# Altium schematic sheet Project2.SchDoc
size A; SheetNumber: 1; SheetTotal: 1
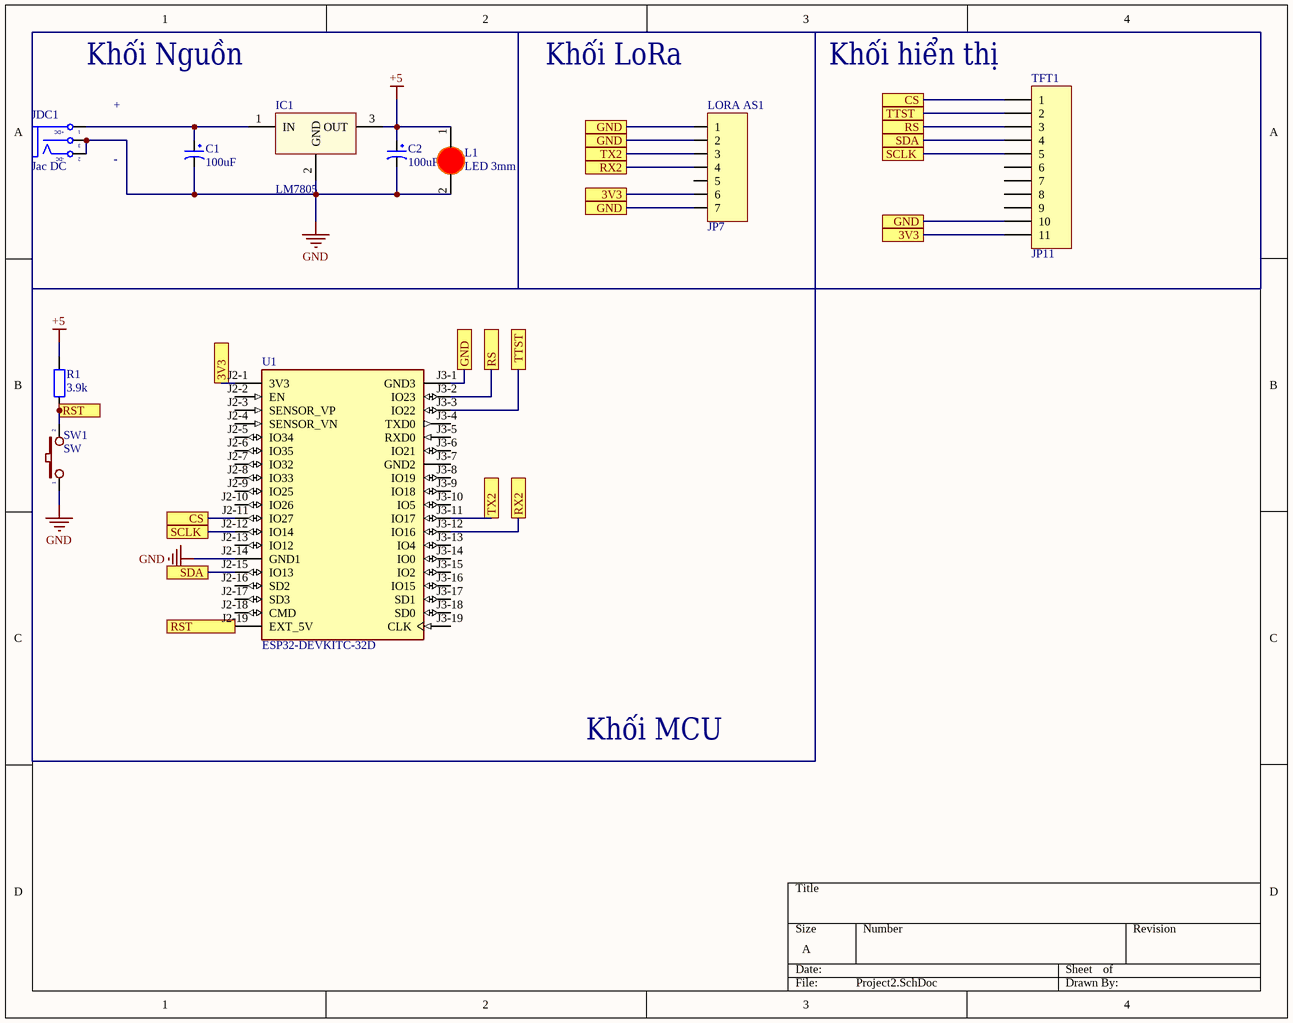
[diagram p0: Project2.SchDoc]

## Parts
C1  100uF  [Tu hoa 10mm]
C2  100uF  [Tu hoa 10mm]
IC1  LM7805  [QTO-220]
JDC1  Jac DC  [DC-IN]
L1  LED 3mm  [LED-3MM-RED]
LORA_AS1  JP7  [JP7-C1C]
R1  3.9k  [tro vach 1/4w]
SW1  SW  [SW2]
TFT1  JP11  [JP11-C1T]
U1  ESP32-DEVKITC-32D  [MODULE_ESP32-DEVKITC-32D]

## Ports
3V3, CS, GND, RS, RST, RX2, SCLK, SDA, TTST, TX2

## Nets
+5: C2.1 IC1.3(OUT) L1.1(A) R1.2
GND: C1.2 C2.2 IC1.2(GND) JDC1.2(TN) JDC1.3(S) L1.2(K) SW1.1 U1.J2-14(GND1)
3V3: LORA_AS1.6 TFT1.11 U1.J2-1(3V3) ; port 3V3
CS: TFT1.1 U1.J2-11(IO27) ; port CS
GND: LORA_AS1.1 LORA_AS1.2 LORA_AS1.7 TFT1.10 U1.J3-1(GND3) ; port GND  [a separate net that carries the same name]
RS: TFT1.3 U1.J3-2(IO23) ; port RS
RST: R1.1 SW1.2 U1.J2-19(EXT_5V) ; port RST
RX2: LORA_AS1.4 U1.J3-12(IO16) ; port RX2
SCLK: TFT1.5 U1.J2-12(IO14) ; port SCLK
SDA: TFT1.4 U1.J2-15(IO13) ; port SDA
TTST: TFT1.2 U1.J3-3(IO22) ; port TTST
TX2: LORA_AS1.3 U1.J3-11(IO17) ; port TX2
NetC1_1: C1.1 IC1.1(IN) JDC1.1(T)

Not connected (* = marked no-connect by the designer): LORA_AS1 5; TFT1 6 7 8 9; U1 J2-2(EN) J2-3(SENSOR_VP) J2-4(SENSOR_VN) J2-5(IO34) J2-6(IO35) J2-7(IO32) J2-8(IO33) J2-9(IO25) J2-10(IO26) J2-13(IO12) J2-16(SD2) J2-17(SD3) J2-18(CMD) J3-4(TXD0) J3-5(RXD0) J3-6(IO21) J3-7(GND2) J3-8(IO19) J3-9(IO18) J3-10(IO5) J3-13(IO4) J3-14(IO0) J3-15(IO2) J3-16(IO15) J3-17(SD1) J3-18(SD0) J3-19(CLK)

## Notes on the sheet
- Khối Nguồn
- Khối LoRa
- (near TFT1) Khối hiển thị
- (near JDC1) +
- (near JDC1) -
- Khối MCU
- (in symbol DCIN) +DC; -DC

## Library data of the parts
C1 C2 = Tu Hoa 100uF 100V 10x20: Cắm; Don_Vi: Con; So_Chan: 2; Ten_Linh_Kien: Tụ Hóa 100uF 100V 10x20MM; Ma_Hang: MH003150; Chung_Loai: Cắm; Kieu_Chan: *
IC1 = LM78xx: On ap +, from + 5 to + 24VDC; Value: LM7805
JDC1 = DCIN: Jac DC input; Value: Jac DC
L1 = LED 3mm Do: Cắm; Don_Vi: Con; Ma_Hang: MH003892; Ten_Linh_Kien: Led 3MM Phủ Đỏ (10c); Ghi_Chu: *; Kieu_Chan: *; Chung_Loai: Cắm
LORA_AS1 = JP7: WR-PHD 2.54 mm Angled Socket Header; Manufacturer: W¨¹rth Elektronik eiSos GmbH; partNo: 613007143121; ComponentLink1 Description: Manufacturer; ComponentLink2 Description: Datasheet; NoPins: 07; Created Date: 29 March 2013; ComponentLink1URL: http://www.we-online.com; ComponentLink2URL: http://katalog.we-online.de/em/datasheet/6130xx143121.pdf; Created by: Karrer Zheng
R1 = Tro Vach 1/4W 5% 9.1k: Cắm; Don_Vi: Con; So_Chan: 2; Ten_Linh_Kien: Trở Vạch 1/4w 5% 9.1k; Ma_Hang: MH008787; Chung_Loai: Cắm; Kieu_Chan: *
SW1 = SW2: Switch button 2 pin; Value: SW chip 2 pin
TFT1 = JP11: WR-PHD 2.54 mm Angled Socket Header; Manufacturer: W¨¹rth Elektronik eiSos GmbH; partNo: 613011143121; ComponentLink1 Description: Manufacturer; ComponentLink2 Description: Datasheet; NoPins: 11; Created Date: 29 March 2013; ComponentLink1URL: http://www.we-online.com; ComponentLink2URL: http://katalog.we-online.de/em/datasheet/6130xx143121.pdf; Created by: Karrer Zheng
U1 = ESP32-DEVKITC-32D: WiFi Development Tools (802.11) ESP32 General Development Kit, ESP32-WROOM-32D on the board; MF: Espressif Systems; SnapEDA_Link: https://www.snapeda.com/parts/ESP32-DEVKITC-32D/Espressif+Systems/view-part/?ref=snap; Package: None; Value: *; MP: ESP32-DEVKITC-32D; Check_prices: https://www.snapeda.com/parts/ESP32-DEVKITC-32D/Espressif+Systems/view-part/?ref=eda